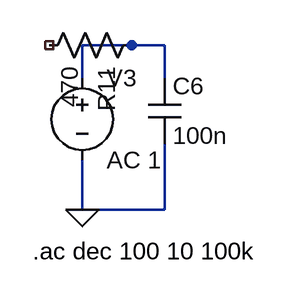
[diagram p0: schematic low_pass_filter.asc]
low_pass_filter.asc, the LTspice schematic file:
Version 4
SHEET 1 880 680
WIRE 16 0 96 0
WIRE 16 0 16 32
WIRE 96 0 96 32
WIRE 16 112 16 160
WIRE 96 96 96 160
WIRE 16 160 96 160
FLAG 16 160 0
SYMBOL res 80 -16 R90
SYMATTR InstName R11
SYMATTR Value 470
SYMBOL cap 80 32 R0
SYMATTR InstName C6
SYMATTR Value 100n
SYMBOL voltage 16 16 R0
SYMATTR InstName V3
SYMATTR Value AC 1
TEXT -32 200 Left 2 !.ac dec 100 10 100k

The netlist it stands for:
* low_pass_filter.asc
R11 N001 NC_01 470
C6 N001 0 100n
V3 N001 0 AC 1
.ac dec 100 10 100k
.backanno
.end